# Altium schematic sheet [15]-MCU_CONNECTORS.SchDoc
size A4
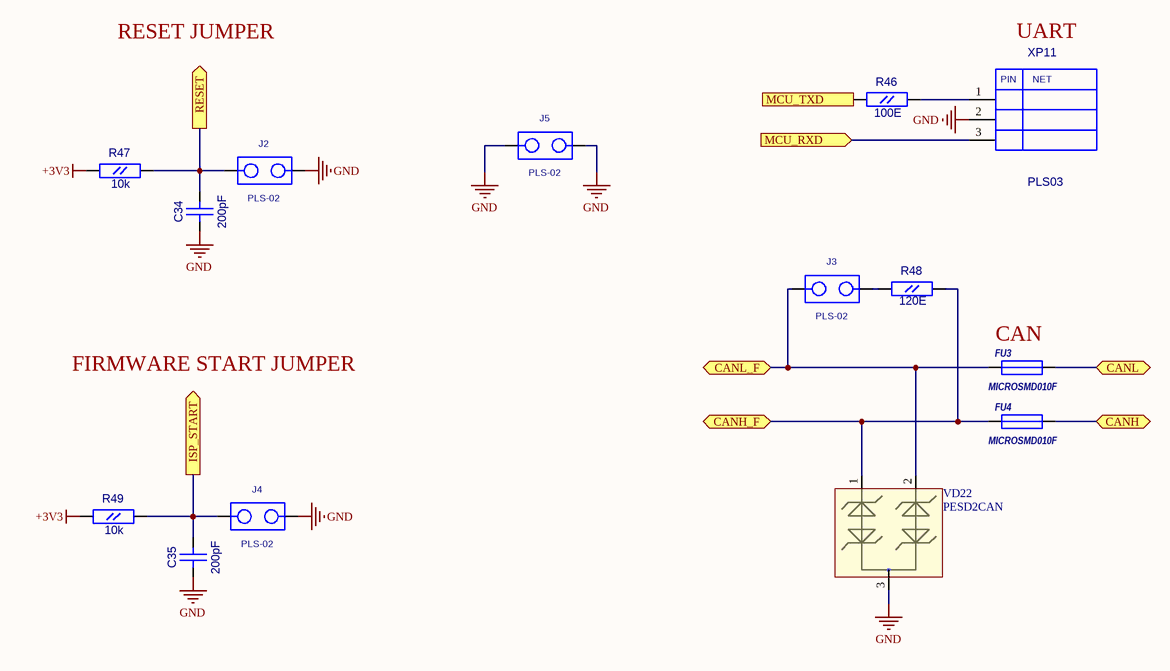
[diagram p0: [15]-MCU_CONNECTORS.SchDoc]

## Parts
C34  200pF  [CC0603]
C35  200pF  [CC0603]
FU3  MICROSMD010F  [RC1210]
FU4  MICROSMD010F  [RC1210]
J2  PLS-02  [PLS-02]
J3  PLS-02  [PLS-02]
J4  PLS-02  [PLS-02]
J5  PLS-02  [PLS-02]
R46  100E  [RC0603]
R47  10k  [RC0603]
R48  120E  [RC0805]
R49  10k  [RC0603]
VD22  PESD2CAN  [SOT-23(123)]
XP11  PLS03  [PLS-03]

## Ports
CANH (bidir), CANH_F (bidir), CANL (bidir), CANL_F (bidir), ISP_START (out), MCU_RXD (in), MCU_TXD (out), RESET (out)

## Nets
+3V3: R47.1(A) R49.1(A)
GND: C34.1(A) C35.1(A) J2.2 J4.2 J5.1 J5.2 VD22.3 XP11.2
CANH: FU4.2 ; port CANH
CANH_F: FU4.1 R48.2(B) VD22.1 ; port CANH_F
CANL: FU3.2 ; port CANL
CANL_F: FU3.1 J3.1 VD22.2 ; port CANL_F
ISP_START: C35.2(B) J4.1 R49.2(B) ; port ISP_START
MCU_RXD: XP11.3 ; port MCU_RXD
MCU_TXD: R46.1(A) ; port MCU_TXD
RESET: C34.2(B) J2.1 R47.2(B) ; port RESET
NetJ3_2: J3.2 R48.1(A)
NetR46_2: R46.2(B) XP11.1

## Notes on the sheet
- RESET JUMPER
- UART
- FIRMWARE START JUMPER
- (near FU3) CAN
- (in symbol PLS03) PIN; NET

## Library data of the parts
C34 C35 = CC0603: Value: 200pF
FU3 FU4 = MICROSMD: Value: *
R46 R47 R49 = RC0603
  R46: Value: 100E
  R47 R49: Value: 10k
R48 = RC0805: Value: 120E
VD22 = PESD2CAN: TVS for CAN
J2-J5 = PLS-02: Value: *
XP11 = PLS03: Value: *